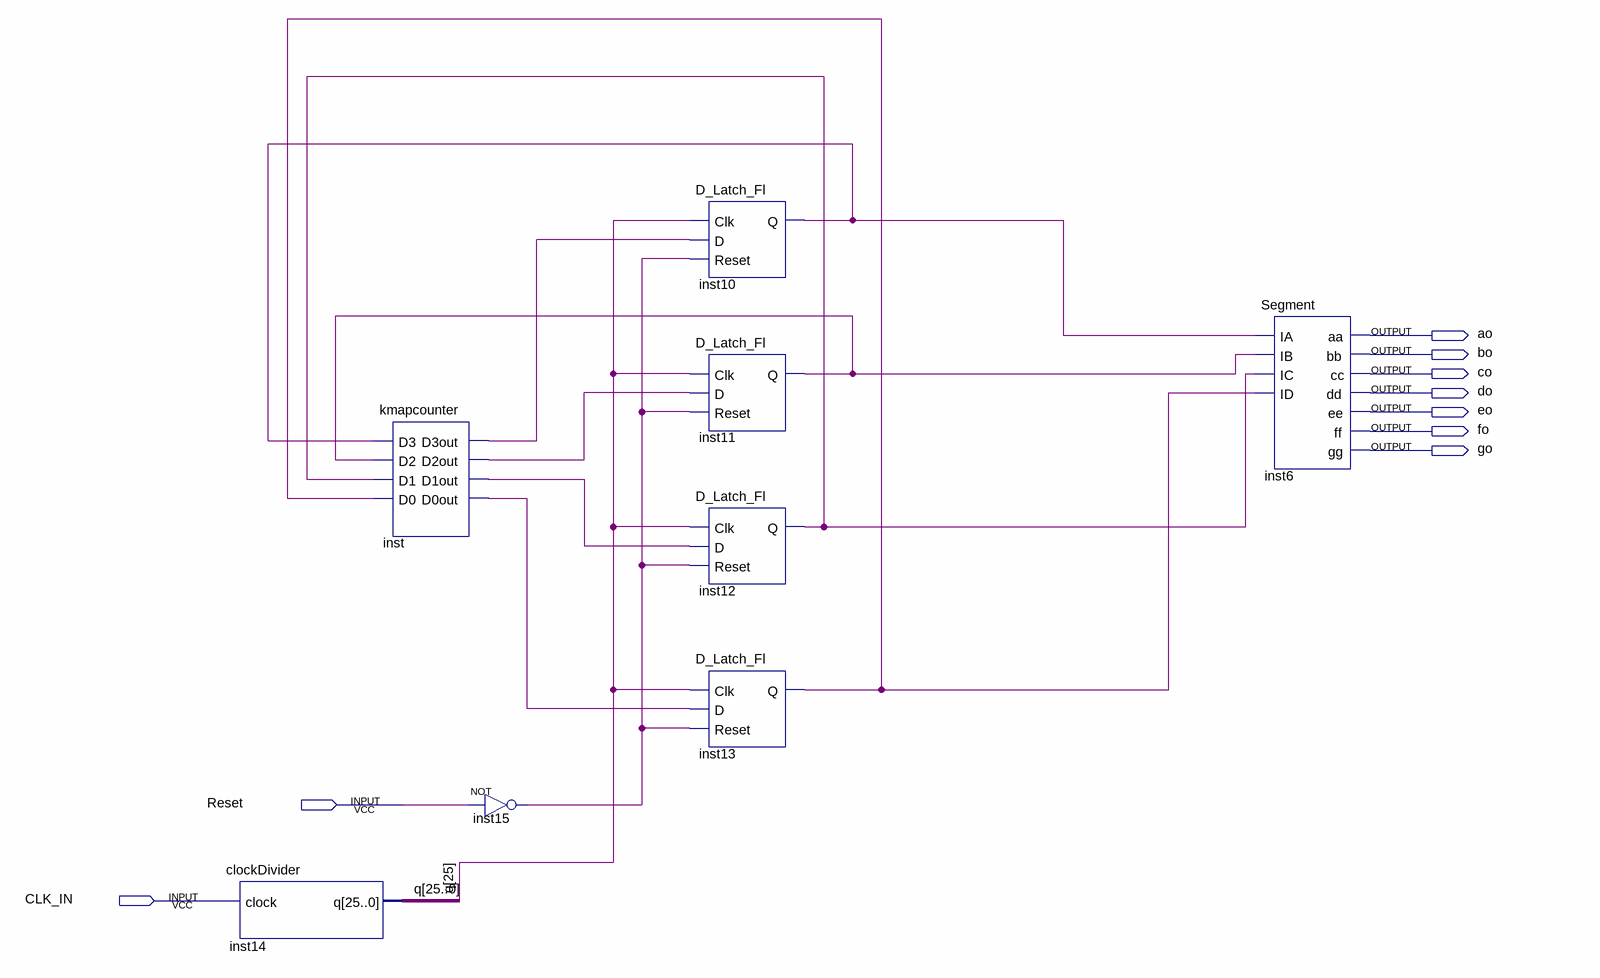
[diagram p0: schematic sheet]
// Quartus schematic counter1.bdf as structural Verilog: 8 symbols, 9 pins
module counter1 (
  input  Reset,
  input  CLK_IN,
  output ao,
  output bo,
  output co,
  output \do ,
  output eo,
  output fo,
  output go
);

  wire inst10_q, inst11_q, inst12_q, inst13_q, inst15_out, inst_d0out, inst_d1out, inst_d2out, inst_d3out;
  wire [25:0] q;

  clockDivider inst14 (.clock(CLK_IN), .q(q));
  kmapcounter inst (
    .D3(inst10_q), .D2(inst11_q), .D1(inst12_q), .D0(inst13_q), .D3out(inst_d3out), .D2out(inst_d2out),
    .D1out(inst_d1out), .D0out(inst_d0out));
  not inst15 (inst15_out, Reset);
  D_Latch_Fl inst10 (.Clk(q[25]), .D(inst_d3out), .Reset(inst15_out), .Q(inst10_q));
  D_Latch_Fl inst11 (.Clk(q[25]), .D(inst_d2out), .Reset(inst15_out), .Q(inst11_q));
  D_Latch_Fl inst12 (.Clk(q[25]), .D(inst_d1out), .Reset(inst15_out), .Q(inst12_q));
  D_Latch_Fl inst13 (.Clk(q[25]), .D(inst_d0out), .Reset(inst15_out), .Q(inst13_q));
  Segment inst6 (
    .IA(inst10_q), .IB(inst11_q), .IC(inst12_q), .ID(inst13_q), .aa(ao), .bb(bo), .cc(co), .dd(\do ),
    .ee(eo), .ff(fo), .gg(go));
endmodule
